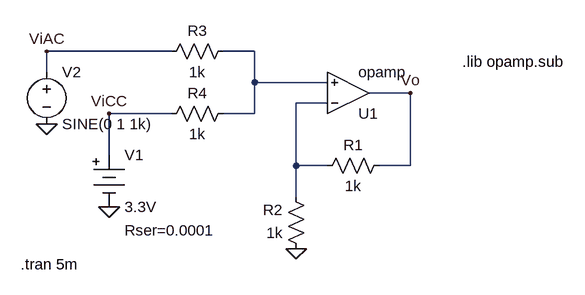
[diagram p0: schematic TPLab2_Grupo2_CorrectorNivelTension_Simulacion.asc]
TPLab2_Grupo2_CorrectorNivelTension_Simulacion.asc, the LTspice schematic file:
Version 4
SHEET 1 880 680
WIRE -80 96 -272 96
WIRE 48 96 0 96
WIRE -272 128 -272 96
WIRE 48 144 48 96
WIRE 160 144 48 144
WIRE 288 160 224 160
WIRE 160 176 112 176
WIRE -80 192 -176 192
WIRE 48 192 48 144
WIRE 48 192 0 192
WIRE -176 256 -176 192
WIRE 112 272 112 176
WIRE 160 272 112 272
WIRE 288 272 288 160
WIRE 288 272 240 272
WIRE 112 320 112 272
FLAG 288 160 Vo
FLAG 112 400 0
FLAG -176 336 0
FLAG -272 208 0
FLAG -272 96 ViAC
FLAG -176 192 ViCC
SYMBOL res 256 256 R90
WINDOW 0 0 56 VBottom 2
WINDOW 3 32 56 VTop 2
SYMATTR InstName R1
SYMATTR Value 1k
SYMBOL res 128 416 R180
WINDOW 0 36 76 Left 2
WINDOW 3 36 40 Left 2
SYMATTR InstName R2
SYMATTR Value 1k
SYMBOL OpAmps\\opamp 192 224 M180
SYMATTR InstName U1
SYMBOL res 16 80 R90
WINDOW 0 0 56 VBottom 2
WINDOW 3 32 56 VTop 2
SYMATTR InstName R3
SYMATTR Value 1k
SYMBOL res 16 176 R90
WINDOW 0 0 56 VBottom 2
WINDOW 3 32 56 VTop 2
SYMATTR InstName R4
SYMATTR Value 1k
SYMBOL Misc\\battery -176 240 R0
WINDOW 123 0 0 Left 0
WINDOW 39 24 132 Left 2
SYMATTR SpiceLine Rser=0.0001
SYMATTR InstName V1
SYMATTR Value 3.3V
SYMBOL voltage -272 112 R0
WINDOW 123 0 0 Left 0
WINDOW 39 0 0 Left 0
SYMATTR InstName V2
SYMATTR Value SINE(0 1 1k)
TEXT 368 112 Left 2 !.lib opamp.sub
TEXT -312 424 Left 2 !.tran 5m

The netlist it stands for:
* TPLab2_Grupo2_CorrectorNivelTension_Simulacion.asc
R1 Vo N002 1k
R2 0 N002 1k
XU1 N002 N001 Vo opamp Aol=100K GBW=10Meg  ; pins invin noninvin out
R3 N001 ViAC 1k
R4 N001 ViCC 1k
V1 ViCC 0 3.3V Rser=0.0001
V2 ViAC 0 SINE(0 1 1k)
.lib opamp.sub
.tran 5m
.backanno
.end